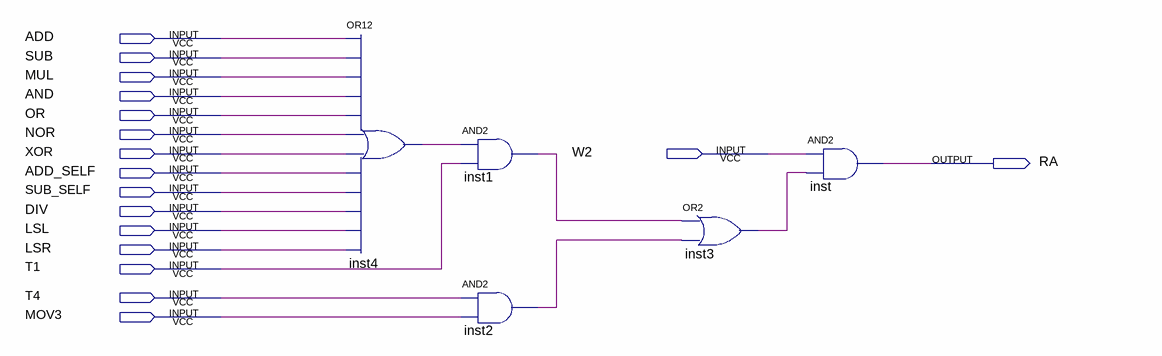
[diagram p0: schematic sheet]
// Quartus schematic RA.bdf as structural Verilog: 5 symbols, 17 pins
module RA (
  input  ADD,
  input  SUB,
  input  MUL,
  input  AND,
  input  OR,
  input  NOR,
  input  XOR,
  input  W2,
  input  ADD_SELF,
  input  SUB_SELF,
  input  DIV,
  input  LSL,
  input  LSR,
  input  T1,
  input  T4,
  input  MOV3,
  output RA
);

  wire inst1_out, inst2_out, inst3_out, inst4_out;

  or inst4 (inst4_out, ADD, SUB, MUL, AND, OR, NOR, XOR, ADD_SELF, SUB_SELF, DIV, LSL, LSR);
  and inst1 (inst1_out, inst4_out, T1);
  and inst2 (inst2_out, T4, MOV3);
  or inst3 (inst3_out, inst1_out, inst2_out);
  and inst (RA, W2, inst3_out);
endmodule
